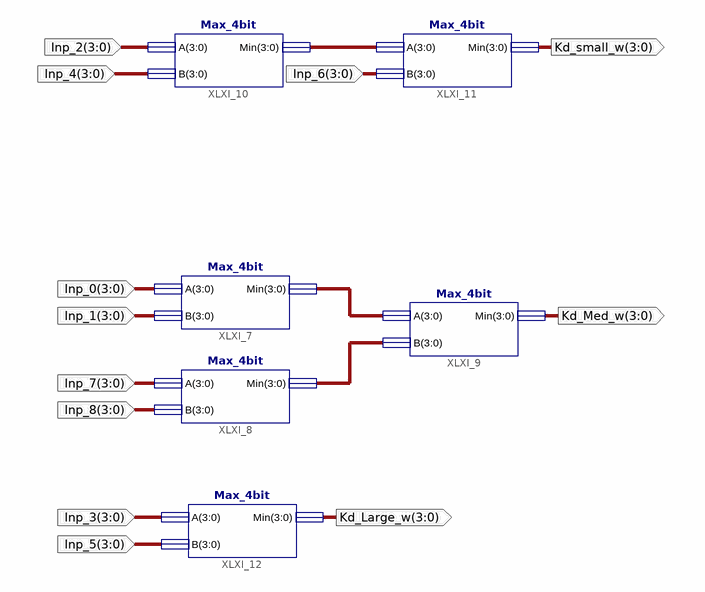
[diagram p0: schematic sheet 1]
// Xilinx ISE schematic Kd_Deffuzy.sch (spartan3e) as structural Verilog: 6 symbols, 12 ports
module Kd_Deffuzy (
  input  [3:0] Inp_4,
  input  [3:0] Inp_0,
  input  [3:0] Inp_8,
  input  [3:0] Inp_6,
  input  [3:0] Inp_2,
  input  [3:0] Inp_3,
  input  [3:0] Inp_1,
  input  [3:0] Inp_5,
  input  [3:0] Inp_7,
  output [3:0] Kd_small_w,
  output [3:0] Kd_Med_w,
  output [3:0] Kd_Large_w
);

  wire [3:0] XLXN_24, XLXN_25, XLXN_27;

  Max_4bit XLXI_7 (.A(Inp_0), .B(Inp_1), .Min(XLXN_25));
  Max_4bit XLXI_8 (.A(Inp_7), .B(Inp_8), .Min(XLXN_27));
  Max_4bit XLXI_9 (.A(XLXN_25), .B(XLXN_27), .Min(Kd_Med_w));
  Max_4bit XLXI_10 (.A(Inp_2), .B(Inp_4), .Min(XLXN_24));
  Max_4bit XLXI_11 (.A(XLXN_24), .B(Inp_6), .Min(Kd_small_w));
  Max_4bit XLXI_12 (.A(Inp_3), .B(Inp_5), .Min(Kd_Large_w));
endmodule
